# Altium schematic sheet USB.SchDoc
size A; SheetNumber: 2; SheetTotal: 3
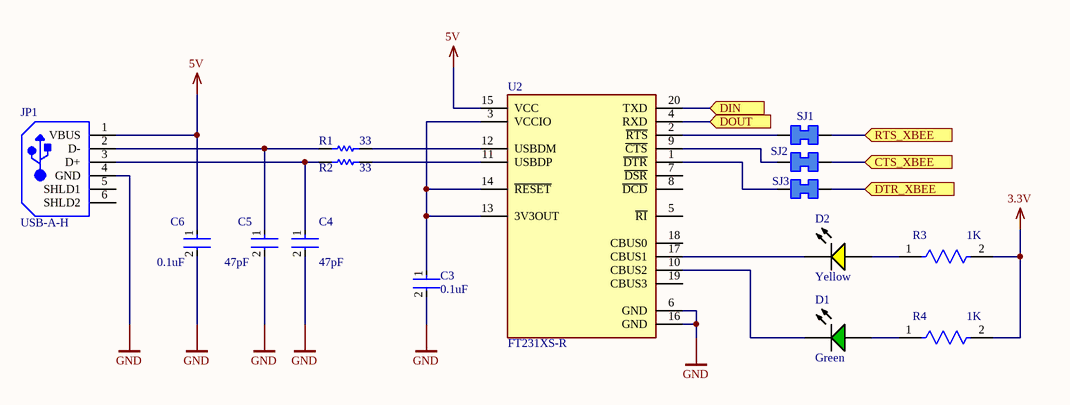
[diagram p0: USB.SchDoc]

## Parts
C3  0.1uF  [FP-C0402-BB-MFG]
C4  47pF  [FP-C0805C-DN-MFG]
C5  47pF  [FP-C0805C-DN-MFG]
C6  0.1uF  [FP-C0402-BB-MFG]
D1  Green  [AVAG-HSMX-C170_V]
D2  Yellow  [AVAG-HSMX-C190_V]
JP1  USB-A-H  [TE-292303-1_V]
R1  33  [RESC0603X26X15ML03T05]
R2  33  [RESC0603X26X15ML03T05]
R3  1K  [FP-ERJ1GN-IPC_C]
R4  1K  [FP-ERJ1GN-IPC_C]
SJ1  Solder Jumper  [Solder Jumper-Footprint-1]  (value not drawn)
SJ2  Solder Jumper  [Solder Jumper-Footprint-1]  (value not drawn)
SJ3  Solder Jumper  [Solder Jumper-Footprint-1]  (value not drawn)
U2  FT231XS-R  [FP-SSOP-20-MFG]

## Ports
CTS_XBEE (in), DIN (in), DOUT (in), DTR_XBEE (in), RTS_XBEE (in)

## Nets
3.3V: R3.2 R4.2
5V: C6.1 JP1.1(VBUS) U2.15(VCC)
GND: C3.2 C4.2 C5.2 C6.2 JP1.4(GND) U2.6(GND) U2.16(GND)
CTS_XBEE: SJ2.2 ; port CTS_XBEE
DIN: U2.20(TXD) ; port DIN
DOUT: U2.4(RXD) ; port DOUT
DTR_XBEE: SJ3.2 ; port DTR_XBEE
RTS_XBEE: SJ1.2 ; port RTS_XBEE
NetC3_1: C3.1 U2.3(VCCIO) U2.13(3V3OUT) U2.14(~{RESET})
NetC4_1: C4.1 JP1.3(D+) R2.1
NetC5_1: C5.1 JP1.2(D-) R1.1
NetD1_1: D1.1(A) R4.1
NetD1_2: D1.2(K) U2.10(CBUS2)
NetD2_1: D2.1(A) R3.1
NetD2_2: D2.2(K) U2.17(CBUS1)
NetR1_2: R1.2 U2.12(USBDM)
NetR2_2: R2.2 U2.11(USBDP)
NetSJ1_1: SJ1.1 U2.2(~{RTS})
NetSJ2_1: SJ2.1 U2.9(~{CTS})
NetSJ3_1: SJ3.1 U2.1(~{DTR})

Not connected (* = marked no-connect by the designer): JP1 5(SHLD1) 6(SHLD2); U2 5(~{RI}) 7(~{DSR}) 8(~{DCD}) 18(CBUS0) 19(CBUS3)

## Library data of the parts
C3 C6 = CMP-2008-02046-2: CAP CER 0.1UF 10V X5R 0402; Manufacturer: Kemet; Manufacturer Part Number: C0402C104K8PACTU; Material: Ceramic; Capacitance: 0.10 μF; Temperature Coefficient: 15%; Tolerance: 0.1; Value: 0.10 μF; Package: C0402-BB; Temperature: -55°C to +125°C; ComponentLink2Description: Datasheet; Temperature Characteristic: X5R; Device Class L1: Passive Components; Height: 0.55mm; Lead Free: Yes; ComponentLink2URL: https://content.kemet.com/datasheets/KEM_C1002_X7R_SMD.pdf; Device Class L2: Capacitors; Temperature Range Low: -55°C; Temperature Range High: +125°C; RoHS: TRUE; Octopart: https://octopart.com/c0402c104k8pactu-kemet-140039; Automotive: No; Mouser Description: Capacitor 100 nF 10 VDC 0402; Category: Cap; Voltage Rating: 10 V; Digikey Description: CAP CER 0.1UF 10V X5R 0402; Ipc Land Pattern Name: CAPC10050X50; Device Class L3: Ceramic Capacitors
C4 C5 = CMP-2007-00435-2: CAP CER 47PF 50V C0G/NP0 0805; Manufacturer: KEMET; Manufacturer Part Number: C0805C470J5GACTU; Temperature Characteristic: C0G; Material: Ceramic; Temperature Coefficient: 30ppm/°C; Tolerance: 0.05; Temperature Range High: +125°C; Device Class L1: Passive Components; Device Class L3: Ceramic Capacitors; Lead Free: Yes; Temperature: -55°C to +125°C; Capacitance: 47 pF; Height: 0.88mm; Octopart: https://octopart.com/c0805c470j5gactu-kemet-150274; RoHS: TRUE; Category: Cap; Voltage Rating: 50 V; Automotive: No; Device Class L2: Capacitors; Value: 47 pF; Ipc Land Pattern Name: CAPC200125X78; Temperature Range Low: -55°C; Mouser Description: Multilayer Ceramic Capacitors MLCC - SMD/SMT 50volts 47pF C0G 5%; Package: C0805C-DN; Digikey Description: CAP CER 47PF 50V C0G/NP0 0805; ComponentLink2URL: https://content.kemet.com/datasheets/KEM_C1003_C0G_SMD.pdf; ComponentLink2Description: Datasheet
D1 = CMP-2000-05062-1: Chip LED, Green, 2.2 V, -40 to 85 degC, 2-Pin SMD, Pb-Free, Tape and Reel; Manufacturer: Avago; No. of Pins: 2; Peak Wavelength: 570nm; SVHC: NoSVHC(16-Jun-2014); Dominant Wavelength: 572nm; Forward Current If: 20mA; Viewing Angle: 170deg; Lens Shape: Rectangular; PIV Max: 5V; External Width: 1.25mm; LED Type: Standard; External Depth: 0.8mm; Opto Mounting Orientation: Top; Luminous Intensity: 15mcd; Luminous Intensity Min: 4mcd; Forward Voltage VF Max: 2.6V; External Length / Height: 2mm; Bulb Size: 1.25mmx1.4mm; Light Area Height: 1mm; Voltage Vf Typ: 2.2V; Operating Temperature Max: 85degC; Datasheet Version: Oct-08; MSL: MSL2A-4weeks; Peak Forward Current: 20mA; Package Description: 2-Pin Surface Mount Device, Body 2 x 1.25 mm, Height 0.8 mm; Datasheet URL: https://datasheet.ciiva.com/29280/180495-da-01-en-chip-led-hsmg-c170-gelb-gruen-29280971.pdf; Storage Temperature Min: -40degC; LED Colour: Green; Wavelength Typ: 570nm; Mounting Type: SMD; Forward Current If Max: 20mA; Dominant Wavelength Typ: 572nm; LED Mounting: SMD; Operating Temperature Range: -30degCto+85degC; Operating Temperature Min: -30degC; Manufacturer URL: http://www.avagotech.com/; Packaging: CutTape; Luminous Intensity Typ: 15mcd; Package Reference: HSMX-C170; Storage Temperature Max: 85degC; Opto Case Style: SMD; Forward Voltage: 2.2V
D2 = CMP-1744-00003-1: LED Uni-Color Yellow, 65 mW, 20 mA, -40 to 85 degC, 2-Pin SMD, RoHS, Tape and Reel; Tolerance: 1%; Voltage Rating: 50 V; Power Rating: 100 mW; Case\Package: 0603; Resistance: 390 Ohm; Min Operating Temperature: -55 degC; Length: 1.6 mm; ComponentLink3Description: Package Specification; Mount: Surface Mount; PackageReference: HSMX-C190; ComponentLink2Description: Datasheet; DatasheetVersion: Mar-12; Case Code (Metric): 1608; Pins: 2; Package Quantity: 5000; ComponentLink2URL: http://docs.avagotech.com/docs/AV02-0551EN; ComponentLink1Description: Manufacturer URL; RoHSCompliant: true; Packaging: Tape and Reel; PackageDescription: 2-Pin Surface Mount Device, Body 1.6 x 0.8 mm, Height 0.9 mm; REACH SVHC: No SVHC; ComponentLink3URL: http://www.fairchildsemi.com/dwg/MA/MA03D.pdf; Voltage Rating (DC): 50 V; Width: 0.8 mm; ComponentLink1URL: http://www.avagotech.com/; Max Operating Temperature: 155 degC; Case Code (Imperial): 0603; Height: 0.45 mm
JP1 = CMP-2000-05404-1: 1 Port Right Angle Through Hole Mount Female Type A USB Connector, 4 Position, -55 to 85 degC, RoHS, Tube; Manufacturer: TE Connectivity; Contact Termination Type: Solder; No. of Contacts: 4; Connector Mounting: PCB; SVHC: NoSVHC(16-Jun-2014); Gender: Receptacle; Connector Type: USBA; Package Description: 4-Pin Through Hole Device, Body 14 x 13.13 mm, Pitch 2.5 mm; Contact Plating: Gold; Package Reference: 292303-1; Contact Material: Copper; Datasheet URL: http://www.farnell.com/cad/1653030.pdf; Datasheet Version: Feb-12; Manufacturer URL: http://www.te.com/
R1 R2 = CMP-2004-03506-1: Manufacturer: Panasonic; Part Number: ERJ1GNF33R0C
R3 R4 = CMP-1010-00416-3: RES SMD 1K OHM 1% 1/20W 0201; Temperature Coefficient: 200ppm/°C; Max Power Dissipation: 50mW; Voltage Rating (DC): 25V; Resistance: 1kR; Number of Pins: 2; Height: 0.01inch; Weight: 6E-06oz; Min Operating Temperature: -55°C; Features: Automotive AEC-Q200; Radiation Hardening: No; Resistor Type: Thick Film; RoHS Compliant: Yes; Termination: SMD/SMT; Package Quantity: 15000; Size Code: 0201; Case Code (Imperial): 0201; Resistance Tolerance: 1%; Contact Plating: Tin; Case/Package: 0201; Lead Free: Lead Free; Number of Terminations: 2; Tolerance: 1%; Max Operating Temperature: 125°C; Mount: Surface Mount; Width: 0.012inch; Series: ERJ; Voltage Rating: 25V; Power Rating: 50mW; Packaging: Tape and Reel; Length: 0.6mm; Case Code (Metric): 0603
SJ1-SJ3 = CMP-00030-00001-2: 2 pad Solder Jumper
U2 = CMP-0248-00024-3: IC USB SERIAL FULL UART 20SSOP; Operating Supply Voltage: 5V; Operating Supply Current: 8mA; Number of Channels: 1; Min Supply Voltage: 2.97V; Max Supply Voltage: 5.5V; Data Rate: 12Mbps; Height: 0.059inch; Packaging: Tape and Reel; Mount: Surface Mount; Package Quantity: 2000; Radiation Hardening: No; Case/Package: SSOP; Min Operating Temperature: -40°C; Width: 0.157inch; Number of Pins: 20; Weight: 0.016oz; Interface: UART; Max Operating Temperature: 85°C; Length: 8.74mm